# Altium schematic sheet Automatic Water Plant system.SchDoc
size A4
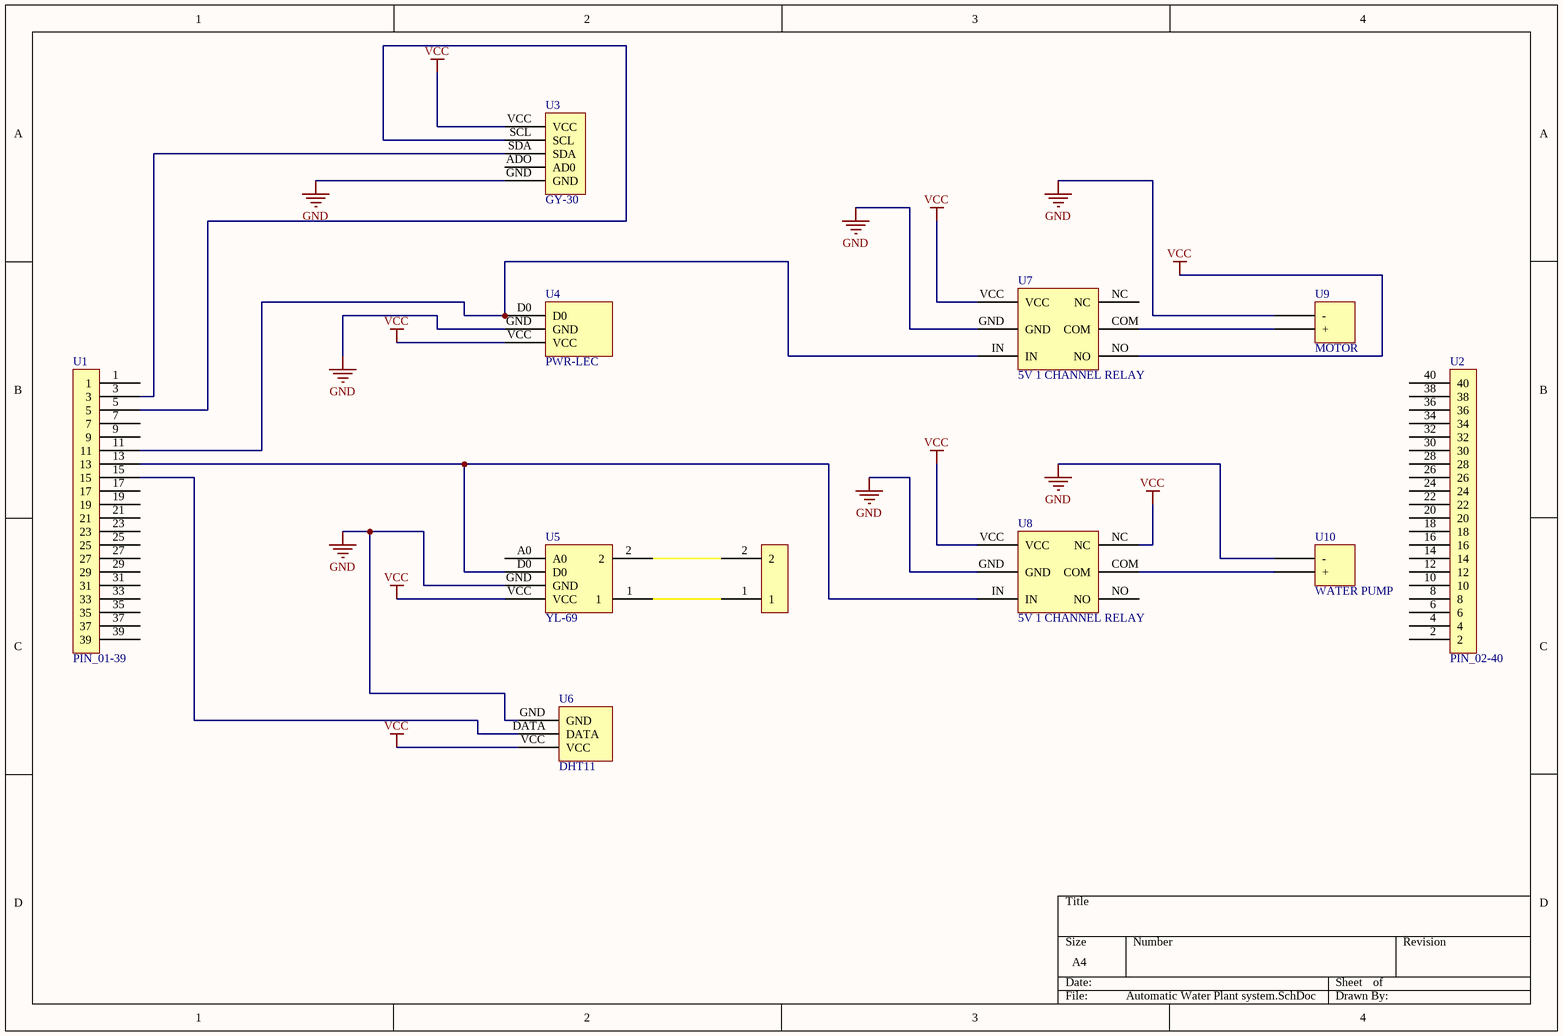
[diagram p0: Automatic Water Plant system.SchDoc]

## Parts
U1  PIN_01-39
U2  PIN_02-40
U3  GY-30
U4  PWR-LEC
U5  YL-69
U6  DHT11
U7  5V 1 CHANNEL RELAY
U8  5V 1 CHANNEL RELAY
U9  MOTOR
U10  WATER PUMP

## Nets
GND: U3.GND U4.GND U5.GND U6.GND U7.GND U8.GND U9.?2(-) U10.?2(-)
VCC: U3.VCC U4.VCC U5.VCC U6.VCC U7.NO U7.VCC U8.NC U8.VCC
NetU1_3: U1.3 U3.SDA
NetU1_5: U1.5 U3.SCL
NetU1_11: U1.11 U4.D0 U7.IN
NetU1_13: U1.13 U5.D0 U8.IN
NetU1_15: U1.15 U6.DATA
NetU7_COM: U7.COM U9.?1(+)
NetU8_COM: U8.COM U10.?1(+)

Not connected (* = marked no-connect by the designer): U1 1 7 9 17 19 21 23 25 27 29 31 33 35 37 39; U2 2 4 6 8 10 12 14 16 18 20 22 24 26 28 30 32 34 36 38 40; U3 ADO(AD0); U5 1 2 A0; U7 NC; U8 NO

## Library data of the parts
U5 = GY-69
U9 U10 = MOTOR & WATER PUMP